# Altium project ESP32主控.PrjPcb
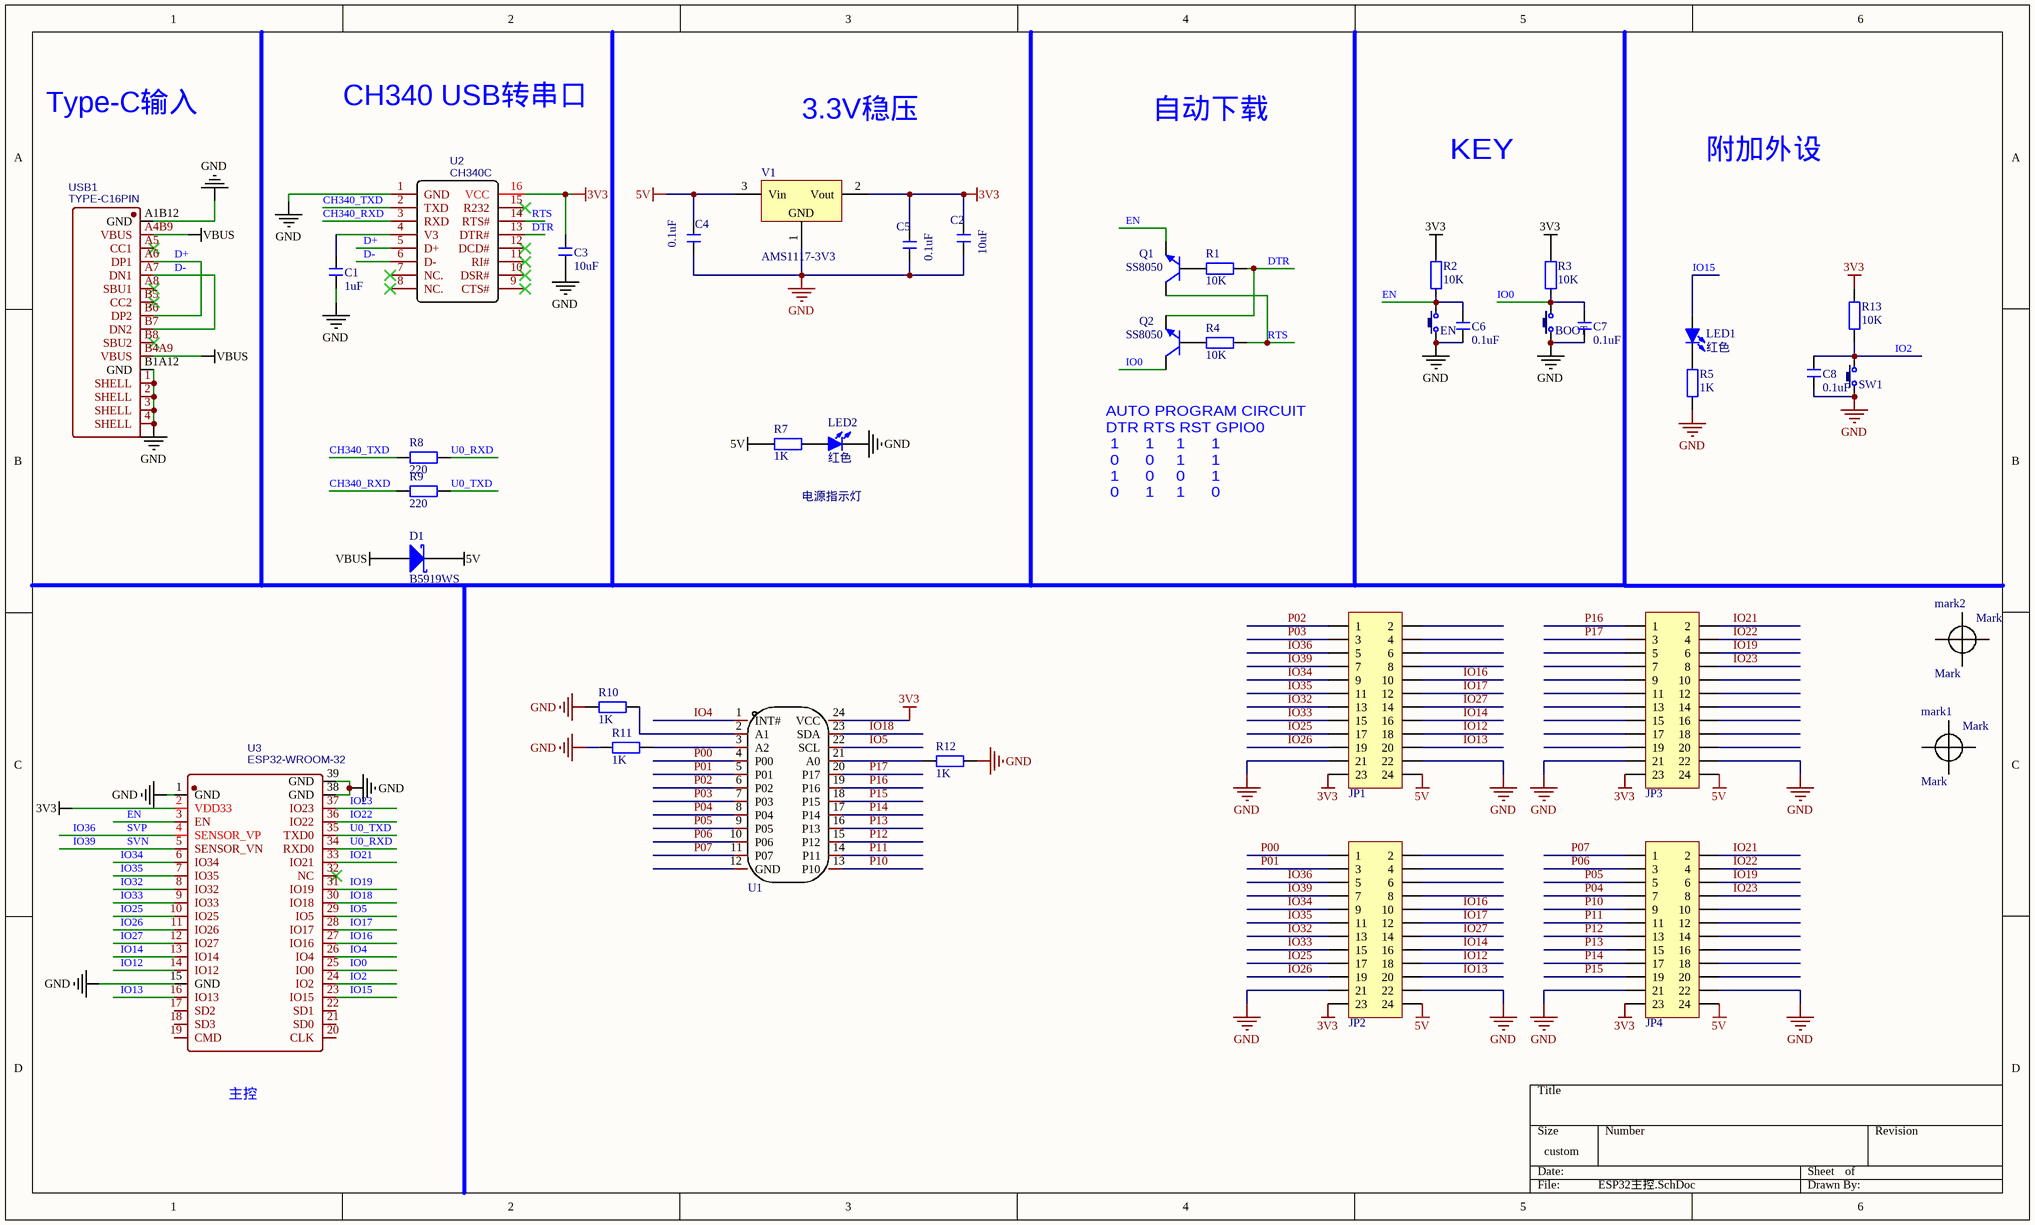
[diagram p0: ESP32主控.SchDoc]
1 sheet, 39 parts. Net scope: global (net labels, ports and power ports of the same name join across sheets).
Board file: ESP32主控.PcbDoc

## Sheet ESP32主控.SchDoc
size 381 x 228 mm; SheetNumber: 1; SheetTotal: 1

### Parts
BOOT  3x6x5  [TSW SMD-3*6*2.5]  (value not drawn)
C1  1uF  [C 0603_L]
C2  10uF  [C 0603_M]
C3  10uF  [C 0603_L]
C4  0.1uF  [C 0603_M]
C5  0.1uF  [C 0603_M]
C6  0.1uF  [C 0603_L]
C7  0.1uF  [C 0603_L]
C8  0.1uF  [C 0603_L]
D1  B5919WS  [SOD-323]
EN  3x6x5  [TSW SMD-3*6*2.5]  (value not drawn)
JP1  Header 2X11  [HDR2.54-WI-2x12P]  (value not drawn)
JP2  Header 2X11  [HDR2.54-WI-2x12P]  (value not drawn)
JP3  Header 2X11  [HDR2.54-WI-2x12P]  (value not drawn)
JP4  Header 2X11  [HDR2.54-WI-2x12P]  (value not drawn)
LED1  红色  [LED 0603R]
LED2  红色  [LED 0603R]
mark1  Mark  [Mark]  (no BOM)
mark2  Mark  [Mark]  (no BOM)
Q1  SS8050  [SOT23-3N]
Q2  SS8050  [SOT23-3N]
R1  10K  [R 0603_L]
R2  10K  [R 0603_L]
R3  10K  [R 0603_L]
R4  10K  [R 0603_L]
R5  1K  [R 0603_L]
R7  1K  [R 0603_L]
R8  220  [R 0603_L]
R9  220  [R 0603_L]
R10  1K  [R 0603_L]
R11  1K  [R 0603_L]
R12  1K  [R 0603_L]
R13  10K  [R 0603_L]
SW1  3x6x5  [TSW SMD-3*6*2.5]  (value not drawn)
U1  PCA9555DW  [PCA9555DW]  (value not drawn)
U2  CH340C  [SOP-16_L10.0-W3.9-P1.27-LS6.0-BL]
U3  ESP32-WROOM-32  [WIFIM-SMD_39P-L25.5-W18.0-P1.27]
USB1  TYPE-C16PIN  [USB-C-SMD_TYPE-C16PIN]
V1  AMS1117-3V3  [SOT223_L]

### Nets
3V3: C2.2 C3.2 C5.2 JP1.23 JP2.23 JP3.23 JP4.23 R2.2 R3.2 R13.2 U1.24(VCC) U2.16(VCC) U3.2(VDD33) V1.2(Vout)
5V: C4.2 D1.2(K) JP1.24 JP2.24 JP3.24 JP4.24 R7.1 V1.3(Vin)
GND: BOOT.1 C1.1 C2.1 C3.1 C4.1 C5.1 C6.1 C7.1 C8.1 EN.1 JP1.21 JP1.22 JP2.21 JP2.22 JP3.21 JP3.22 JP4.21 JP4.22 LED2.2(K) R5.1 R10.1 R11.1 R12.2 SW1.1 U2.1(GND) U3.1(GND) U3.15(GND) U3.38(GND) U3.39(GND) USB1.1(SHELL) USB1.2(SHELL) USB1.3(SHELL) USB1.4(SHELL) USB1.A1B12(GND) USB1.B1A12(GND) V1.1(GND)
VBUS: D1.1(A) USB1.A4B9(VBUS) USB1.B4A9(VBUS)
CH340_RXD: R9.1 U2.3(RXD)
CH340_TXD: R8.1 U2.2(TXD)
D+: U2.5(D+) USB1.A6(DP1) USB1.B6(DP2)
D-: U2.6(D-) USB1.A7(DN1) USB1.B7(DN2)
DTR: Q2.2(E) R1.2 U2.13(DTR#)
EN: C6.2 EN.2 Q1.2(E) R2.1 U3.3(EN)
IO0: BOOT.2 C7.2 Q2.3(C) R3.1 U3.25(IO0)
IO2: C8.2 R13.1 SW1.2 U3.24(IO2)
IO4: U1.1(INT#) U3.26(IO4)
IO5: U1.22(SCL) U3.29(IO5)
IO12: JP1.18 JP2.18 U3.14(IO12)
IO13: JP1.20 JP2.20 U3.16(IO13)
IO14: JP1.16 JP2.16 U3.13(IO14)
IO15: LED1.1(A) U3.23(IO15)
IO16: JP1.10 JP2.10 U3.27(IO16)
IO17: JP1.12 JP2.12 U3.28(IO17)
IO18: U1.23(SDA) U3.30(IO18)
IO19: JP3.6 JP4.6 U3.31(IO19)
IO21: JP3.2 JP4.2 U3.33(IO21)
IO22: JP3.4 JP4.4 U3.36(IO22)
IO23: JP3.8 JP4.8 U3.37(IO23)
IO25: JP1.17 JP2.17 U3.10(IO25)
IO26: JP1.19 JP2.19 U3.11(IO26)
IO27: JP1.14 JP2.14 U3.12(IO27)
IO32: JP1.13 JP2.13 U3.8(IO32)
IO33: JP1.15 JP2.15 U3.9(IO33)
IO34: JP1.9 JP2.9 U3.6(IO34)
IO35: JP1.11 JP2.11 U3.7(IO35)
IO36: JP1.5 JP2.5 U3.4(SENSOR_VP)  [also labelled SVP]
IO39: JP1.7 JP2.7 U3.5(SENSOR_VN)  [also labelled SVN]
P00: JP2.1 U1.4(P00)
P01: JP2.3 U1.5(P01)
P02: JP1.1 U1.6(P02)
P03: JP1.3 U1.7(P03)
P04: JP4.7 U1.8(P04)
P05: JP4.5 U1.9(P05)
P06: JP4.3 U1.10(P06)
P07: JP4.1 U1.11(P07)
P10: JP4.9 U1.13(P10)
P11: JP4.11 U1.14(P11)
P12: JP4.13 U1.15(P12)
P13: JP4.15 U1.16(P13)
P14: JP4.17 U1.17(P14)
P15: JP4.19 U1.18(P15)
P16: JP3.1 U1.19(P16)
P17: JP3.3 U1.20(P17)
RTS: Q1.3(C) R4.2 U2.14(RTS#)
U0_RXD: R8.2 U3.34(RXD0)
U0_TXD: R9.2 U3.35(TXD0)
NetC1_2: C1.2 U2.4(V3)
NetLED1_2: LED1.2(K) R5.2
NetLED2_1: LED2.1(A) R7.2
NetQ1_1: Q1.1(B) R1.1
NetQ2_1: Q2.1(B) R4.1
NetR10_2: R10.2 U1.2(A1)
NetR11_2: R11.2 U1.3(A2)
NetR12_1: R12.1 U1.21(A0)

Not connected (* = marked no-connect by the designer): JP1 2 4 6 8; JP2 2 4 6 8; JP3 5 7 9 10 11 12 13 14 15 16 17 18 19 20; JP4 10 12 14 16 18 20; U1 12(GND); U2 7(NC.)* 8(NC.)* 9(CTS#)* 10(DSR#)* 11(RI#)* 12(DCD#)* 15(R232)*; U3 17(SD2) 18(SD3) 19(CMD) 20(CLK) 21(SD0) 22(SD1) 32(NC)*; USB1 A5(CC1)* A8(SBU1)* B5(CC2)* B8(SBU2)*

### Notes on the sheet
- Type-C输入
- CH340 USB转串口
- 3.3V稳压
- 自动下载
- KEY
- 附加外设
- 电源指示灯
- AUTO PROGRAM CIRCUIT
  DTR RTS RST GPIO0
  1      1     1      1
  0      0     1      1
  1      0     0      1
  0      1     1      0
- (near U3) 主控

### Library data of the parts
BOOT EN SW1 = TSW 3x6: 3x6轻触开关; 版权归属: 封装库来自淘宝 ID：黄晶宝石; BOM名称: 3x6轻触开关; 学习资源: https://shop463601444.taobao.com
C1 C3 C6-C8 = C: 贴片电容; BOM名称: 无极性贴片电容; 淘宝ID: 封装库来自淘宝 ID：黄晶宝石; 联系售后，技术支持: https://shop463601444.taobao.com; 唯一出售店铺网址: https://shop463601444.taobao.com
C2 C4 C5 = C: 贴片电容
D1 = 1N5819: 肖特基二极管; 淘宝ID: 封装库来自淘宝 ID：黄晶宝石; 属性: 40V/2A; BOM名称: 肖特基二极管; 欢迎光临: https://shop463601444.taobao.com
JP1-JP4 = Header 12X2: 12*2P接插件; 版权归属: 封装库来自淘宝卖家 ID：黄晶宝石; BOM名称: 12*2P接插件; 学习资源: https://shop463601444.taobao.com
LED1 LED2 = LED-SMD: 贴片LED; 版权归属: 封装库来自淘宝 ID：黄晶宝石; BOM名称: 贴片LED; 学习资源: https://shop463601444.taobao.com
Q1 Q2 = 8050-SMD: 高频放大-NPN型; 版权归属: 封装库来自淘宝 ID：黄晶宝石; 属性: 40V 1.5A 1W 100MHZ; BOM名称: 高频放大-NPN型; 联系售后: https://shop463601444.taobao.com
R1-R5 R7-R13 = R: 贴片电阻; 版权归属: 来自淘宝 ID：黄晶宝石; 封装库来自淘宝卖家 ID：黄晶宝石: 其他店铺购入均为盗版，不享受售后技术支持服务，请立即申请退款; BOM名称: 贴片电阻; 联系售后: https://shop463601444.taobao.com
U1 = PCA9555DW: 具有中断、弱上拉和配置寄存器的 16 位 2.3V 至 5.5V I2C/SMBus I/O 扩展器 24-SOIC -40 to 85; Manufacturer: TI(德州仪器); Add into BOM: yes; Symbol: PCA9555DW; Device: PCA9555DW; LCSC Part Name: PCA9555DW; Supplier Part: C2870300; Manufacturer Part: PCA9555DW; Supplier Footprint: SOIC-24; JLCPCB Part Class: Extended Part; Supplier: LCSC; Convert to PCB: yes
U2 = CH340C: BOM_Manufacturer: WCH; BOM_Paste Type: recommend; BOM_Supplier: LCSC; BOM_Manufacturer Part: CH340C; BOM_Supplier Part: C84681; spicePre: U; spiceSymbolName: CH340C
U3 = ESP32-WROOM-32: BOM_Manufacturer: Espressif Systems; Contributor: LCSC; BOM_Supplier: LCSC; BOM_Supplier Part: C503587; BOM_Manufacturer Part: ESP32-WROOM-32; spicePre: U; spiceSymbolName: ESP32-WROOM-32
USB1 = TYPE-C16PIN: BOM_Manufacturer: SHOU HAN; Contributor: LCSC; BOM_Supplier: LCSC; BOM_Supplier Part: C393939; BOM_Manufacturer Part: TYPE-C16PIN; spicePre: U; spiceSymbolName: TYPE-C16PIN
V1 = AMS1117: 三端稳压芯片; BOM名称: 稳压芯片; 淘宝ID: 封装库来自淘宝 ID：黄晶宝石; 欢迎光临淘宝店铺: https://shop463601444.taobao.com